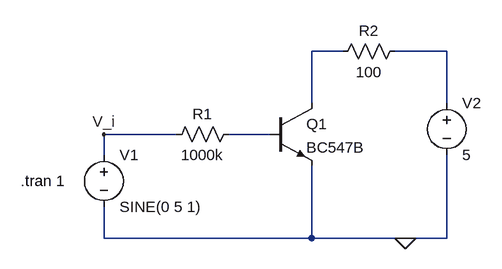
[diagram p0: schematic BasicTransistor.asc]
BasicTransistor.asc, the LTspice schematic file:
Version 4
SHEET 1 880 680
WIRE 176 96 128 96
WIRE 336 96 256 96
WIRE 128 176 128 96
WIRE 336 176 336 96
WIRE -80 224 -192 224
WIRE 64 224 0 224
WIRE -192 256 -192 224
WIRE -192 384 -192 336
WIRE 128 384 128 272
WIRE 128 384 -192 384
WIRE 272 384 128 384
WIRE 336 384 336 256
WIRE 336 384 272 384
FLAG 272 384 0
FLAG -192 224 V_i
SYMBOL voltage -192 240 R0
SYMATTR InstName V1
SYMATTR Value SINE(0 5 1)
SYMBOL npn 64 176 R0
SYMATTR InstName Q1
SYMATTR Value BC547B
SYMBOL res 16 208 R90
WINDOW 0 0 56 VBottom 2
WINDOW 3 32 56 VTop 2
SYMATTR InstName R1
SYMATTR Value 1000k
SYMBOL res 272 80 R90
WINDOW 0 0 56 VBottom 2
WINDOW 3 32 56 VTop 2
SYMATTR InstName R2
SYMATTR Value 100
SYMBOL voltage 336 160 R0
SYMATTR InstName V2
SYMATTR Value 5
TEXT -320 296 Left 2 !.tran 1

The netlist it stands for:
* BasicTransistor.asc
V1 V_i 0 SINE(0 5 1)
Q1 N001 N003 0 0 BC547B
R1 N003 V_i 1000k
R2 N002 N001 100
V2 N002 0 5
.model NPN NPN
.model PNP PNP
.lib standard.bjt
.tran 1
.backanno
.end